# EAGLE design gecko (EAGLE 5.11)

## Sheet 1 of 3
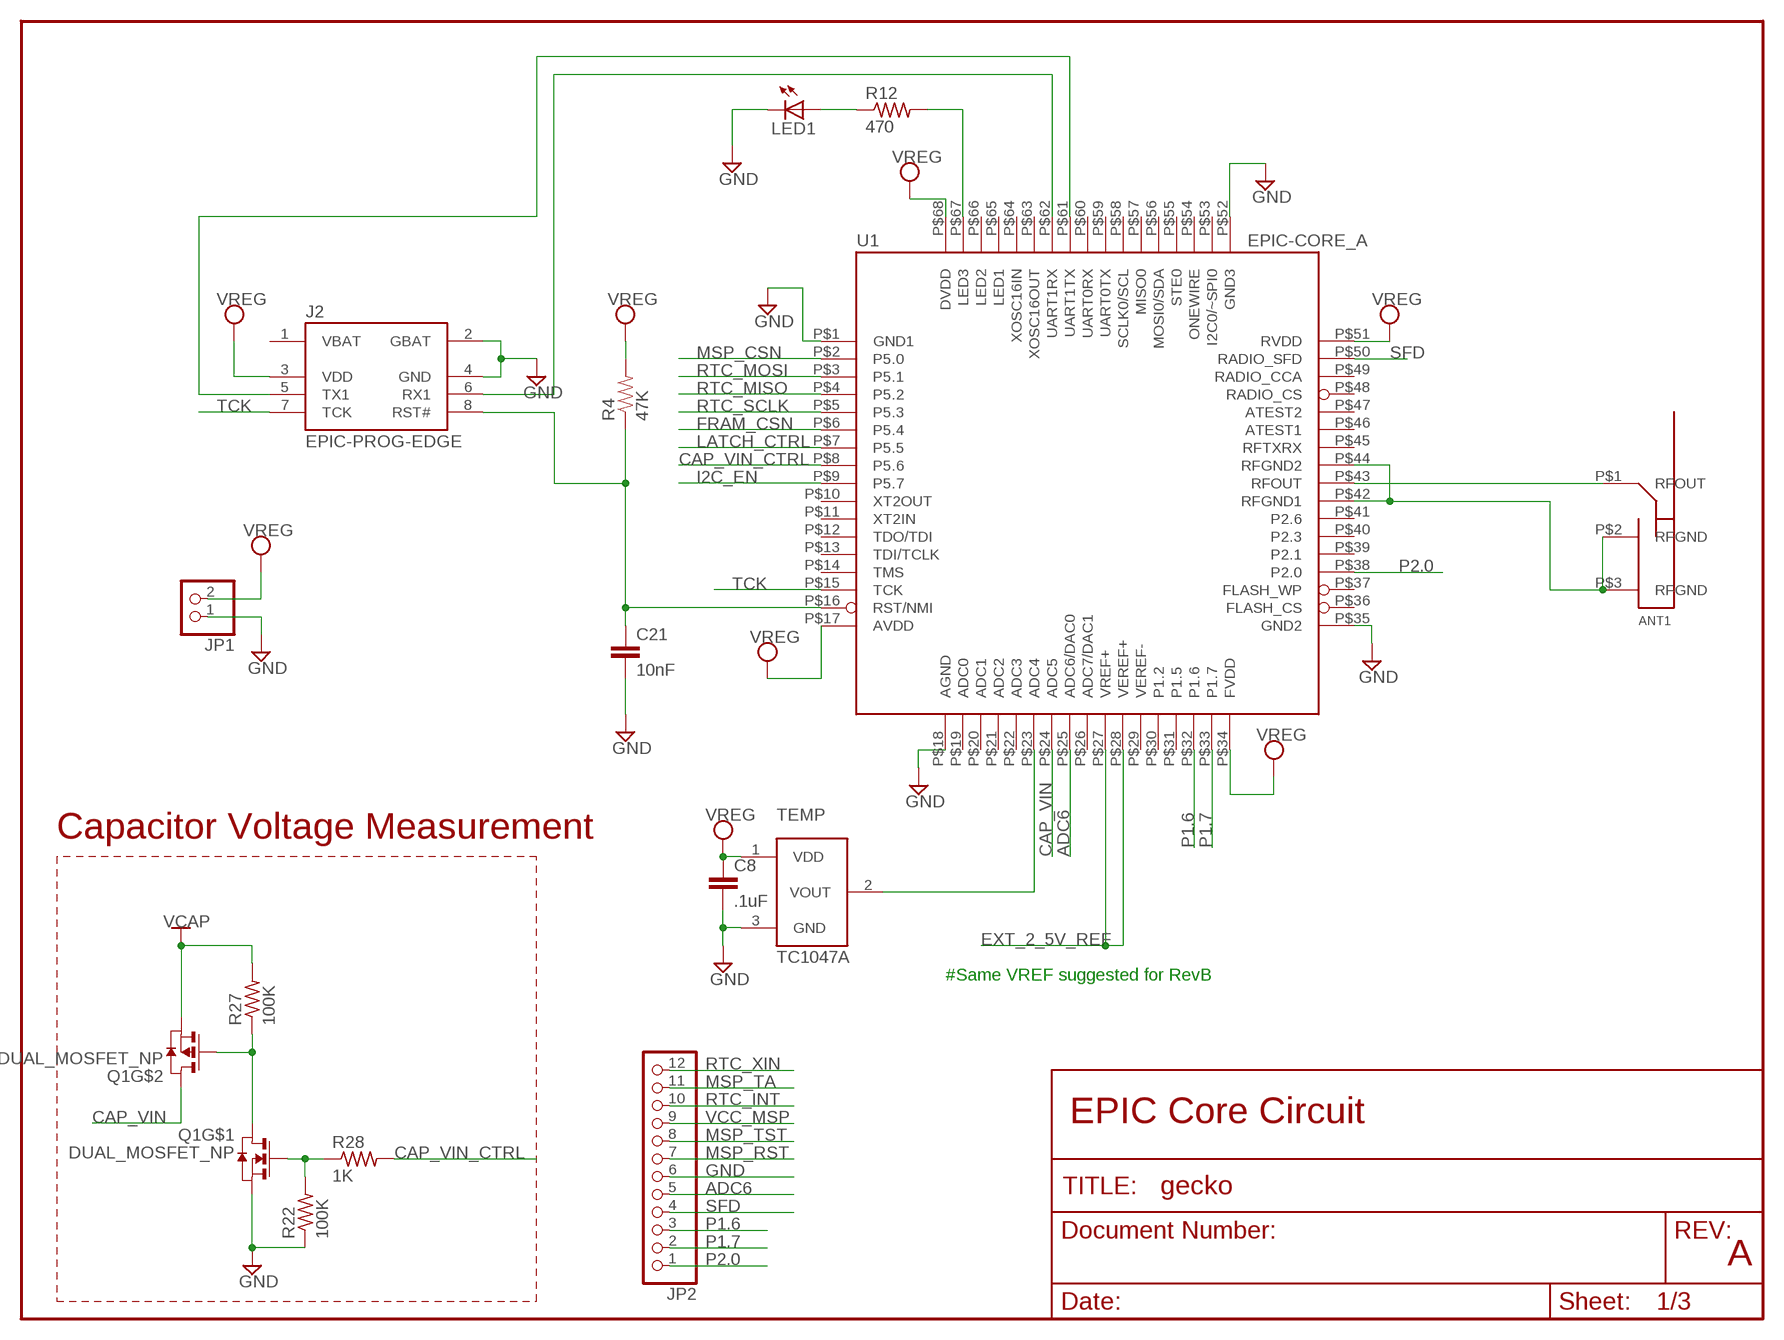
[diagram p0: schematic, sheet 1]

### Parts
ANT1  PIFA-2.4GHZ  [PIFA-2.4GHZ]
C8  .1uF  CAPACITOR  [C0603B]
C21  10nF  CAPACITOR  [C0603B]
J2  EPIC-PROG-EDGE  [EPIC-PROG-EDGE]
JP1  PINHD-1X2M  [1X02M]
JP2  PINHD-1X12M  [1X12M]
LED1  LED0603  [LED-0603]
Q1  DUAL_MOSFET_NP  [TSOP-6]
R4  47K  RESISTOR0603-RES  [0603-RES]
R12  470  RESISTOR  [R0603B]
R22  100K  RESISTOR  [R0603B]
R27  100K  RESISTOR  [R0603B]
R28  1K  RESISTOR  [R0603B]
TEMP  TC1047A  [SOT-23-3]
U1  EPIC-CORE_A  [EPIC-LCC68]

### Nets
ADC6: JP2.5 U1.P$25(ADC6/DAC0)
CAP_VIN: Q1.P$4(D) U1.P$24(ADC5)
CAP_VIN_CTRL: R28.2 U1.P$8(P5.6)
EXT_2_5V_REF: U1.P$27(VREF+) U1.P$28(VEREF+)
FRAM_CSN: U1.P$6(P5.4) ; also sheet 3
GND: C8.2 C21.2 J2.2(GBAT) J2.4(GND) JP1.1 JP2.6 LED1.C Q1.P$5(S) R22.1 TEMP.3(GND) U1.P$1(GND1) U1.P$18(AGND) U1.P$35(GND2) U1.P$52(GND3) ; also sheet 2,3
I2C_EN: U1.P$9(P5.7) ; also sheet 3
LATCH_CTRL: U1.P$7(P5.5) ; also sheet 2
MSP_CSN: U1.P$2(P5.0) ; also sheet 3
MSP_RST: JP2.7 ; also sheet 3
MSP_TA: JP2.11 ; also sheet 3
MSP_TST: JP2.8 ; also sheet 3
N$1: ANT1.P$1(RFOUT) U1.P$43(RFOUT)
N$6: Q1.P$3(G) Q1.P$6(D) R27.1
N$7: J2.6(RX1) U1.P$62(UART1RX)
N$11: J2.5(TX1) U1.P$61(UART1TX)
N$12: Q1.P$1(G) R22.2 R28.1
N$14: R12.2 U1.P$67(LED3)
N$15: LED1.A R12.1
N$17: C21.1 J2.8(RST#) R4.1 U1.P$16(RST/NMI)
N$20: TEMP.2(VOUT) U1.P$23(ADC4)
P1.6: JP2.3 U1.P$32(P1.6)
P1.7: JP2.2 U1.P$33(P1.7)
P2.0: JP2.1 U1.P$38(P2.0)
RFGND: ANT1.P$2(RFGND) ANT1.P$3(RFGND) U1.P$42(RFGND1) U1.P$44(RFGND2)
RTC_INT: JP2.10 ; also sheet 2,3
RTC_MISO: U1.P$4(P5.2) ; also sheet 3
RTC_MOSI: U1.P$3(P5.1) ; also sheet 3
RTC_SCLK: U1.P$5(P5.3) ; also sheet 3
RTC_XIN: JP2.12 ; also sheet 3
SFD: JP2.4 U1.P$50(RADIO_SFD) ; also sheet 3
TCK: J2.7(TCK) U1.P$15(TCK)
VCAP: Q1.P$2(S) R27.2 ; also sheet 2
VCC_MSP: JP2.9 ; also sheet 3
VREG: C8.1 J2.3(VDD) JP1.2 R4.2 TEMP.1(VDD) U1.P$17(AVDD) U1.P$34(FVDD) U1.P$51(RVDD) U1.P$68(DVDD) ; also sheet 2,3
Unconnected: J2.1(VBAT) U1.P$10(XT2OUT) U1.P$11(XT2IN) U1.P$12(TDO/TDI) U1.P$13(TDI/TCLK) U1.P$14(TMS) U1.P$19(ADC0) U1.P$20(ADC1) U1.P$21(ADC2) U1.P$22(ADC3) U1.P$26(ADC7/DAC1) U1.P$29(VEREF-) U1.P$30(P1.2) U1.P$31(P1.5) U1.P$36(FLASH_CS) U1.P$37(FLASH_WP) U1.P$39(P2.1) U1.P$40(P2.3) U1.P$41(P2.6) U1.P$45(RFTXRX) U1.P$46(ATEST1) U1.P$47(ATEST2) U1.P$48(RADIO_CS) U1.P$49(RADIO_CCA) U1.P$53(I2C0/~SPI0) U1.P$54(ONEWIRE) U1.P$55(STE0) U1.P$56(MOSI0/SDA) U1.P$57(MISO0) U1.P$58(SCLK0/SCL) U1.P$59(UART0TX) U1.P$60(UART0RX) U1.P$63(XOSC16OUT) U1.P$64(XOSC16IN) U1.P$65(LED1) U1.P$66(LED2)

### Notes on the sheet
- Capacitor Voltage Measurement
- #Same VREF suggested for RevB
- EPIC Core Circuit
- A

## Sheet 2 of 3
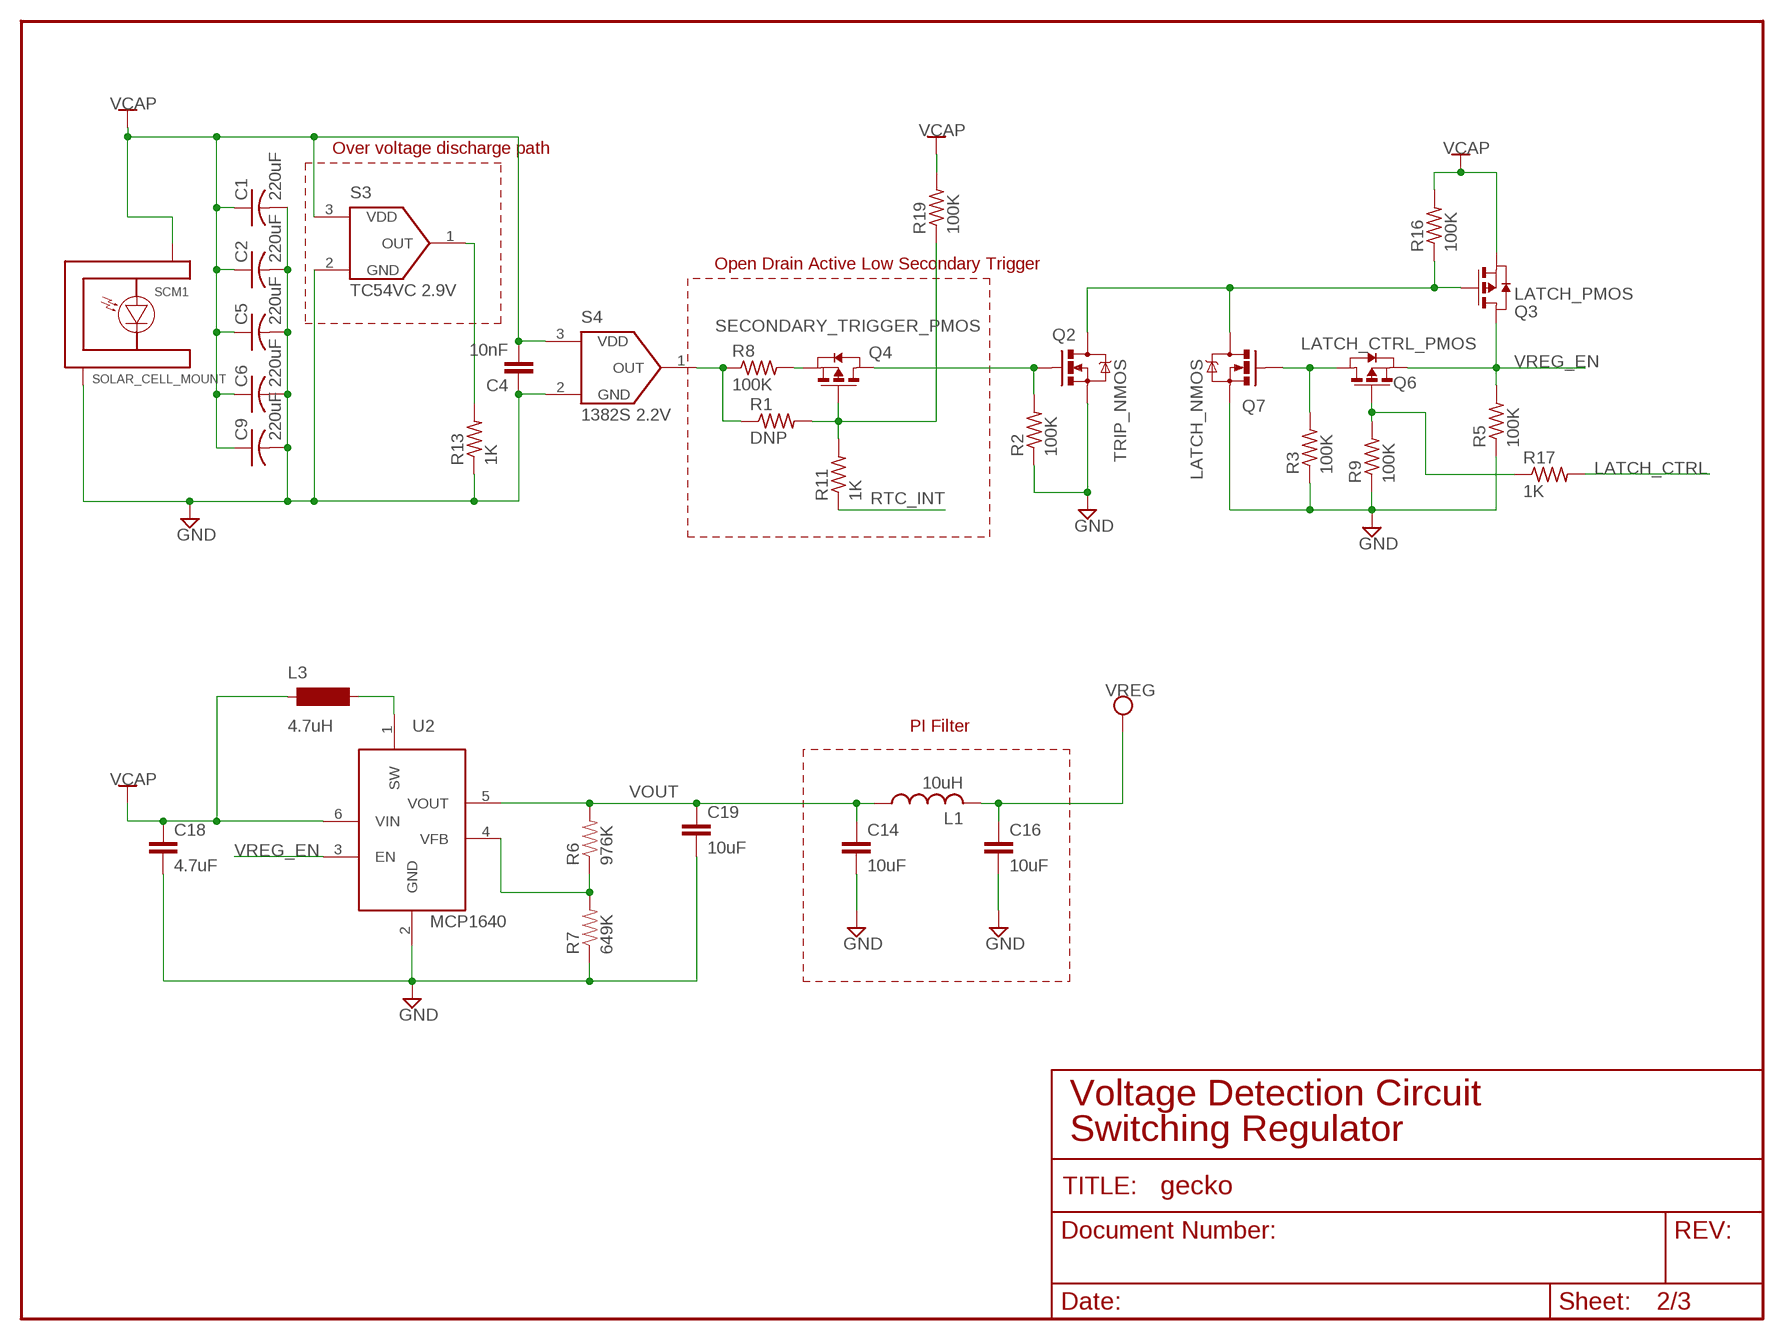
[diagram p1: schematic, sheet 2]

### Parts
C1  220uF  C-USC1206  [C1206]
C2  220uF  C-USC1206  [C1206]
C4  10nF  CAPACITOR  [C0603B]
C5  220uF  C-USC1206  [C1206]
C6  220uF  C-USC1206  [C1206]
C9  220uF  C-USC1206  [C1206]
C14  10uF  CAP0805  [0805]
C16  10uF  CAP0805  [0805]
C18  4.7uF  CAP0603-CAP  [0603-CAP]
C19  10uF  CAP0805  [0805]
L1  10uH  L-USL2012C  [L2012C]
L3  4.7uH  INDUCTOR  [INDUCTOR]
Q2  TRIP_NMOS  MOSFET-NCHANNELSMD  [SOT23-3]
Q3  LATCH_PMOS  PMOSSOT23  [SOT-23]
Q4  SECONDARY_TRIGGER_PMOS  PMOSSOT23  [SOT-23]
Q6  LATCH_CTRL_PMOS  PMOSSOT23  [SOT-23]
Q7  LATCH_NMOS  MOSFET-NCHANNELSMD  [SOT23-3]
R1  DNP  RESISTOR  [R0603B]
R2  100K  RESISTOR  [R0603B]
R3  100K  RESISTOR  [R0603B]
R5  100K  RESISTOR  [R0603B]
R6  976K  RESISTOR0603-RES  [0603-RES]
R7  649K  RESISTOR0603-RES  [0603-RES]
R8  100K  RESISTOR  [R0603B]
R9  100K  RESISTOR  [R0603B]
R11  1K  RESISTOR  [R0603B]
R13  1K  RESISTOR  [R0603B]
R16  100K  RESISTOR  [R0603B]
R17  1K  RESISTOR  [R0603B]
R19  100K  RESISTOR  [R0603B]
S3  TC54VC 2.9V  1382  [SOT-23-3]
S4  1382S 2.2V  1382  [SOT-23-3]
SCM1  SOLAR_CELL_MOUNT  [SOLAR_CELL_MOUNT]
U2  MCP1640  [SOT-23-6]

### Nets
GND: C1.2 C2.2 C4.1 C5.2 C6.2 C9.2 C14.2 C16.2 C18.2 C19.2 Q2.2(S) Q7.2(S) R2.1 R3.1 R5.1 R7.1 R9.1 R13.1 S3.2(GND) S4.2(GND) SCM1.NEG U2.2(GND) ; also sheet 1,3
LATCH_CTRL: R17.2 ; also sheet 1
N$2: Q2.1(G) Q4.1(D) R2.2
N$3: L3.2 U2.1(SW)
N$4: R1.1 R8.1 S4.1(OUT)
N$5: R6.1 R7.2 U2.4(VFB)
N$9: Q2.3(D) Q3.3(G) Q7.3(D) R16.1
N$10: Q4.2(S) R8.2
N$16: R13.2 S3.1(OUT)
N$23: Q6.1(D) Q7.1(G) R3.2
N$24: Q6.3(G) R9.2 R17.1
N$25: Q4.3(G) R1.2 R11.2 R19.1
RTC_INT: R11.1 ; also sheet 1,3
VCAP: C1.1 C2.1 C4.2 C5.1 C6.1 C9.1 C18.1 L3.1 Q3.2(S) R16.2 R19.2 S3.3(VDD) S4.3(VDD) SCM1.POS U2.6(VIN) ; also sheet 1
VOUT: C14.1 C19.1 L1.1 R6.2 U2.5(VOUT)
VREG: C16.1 L1.2 ; also sheet 1,3
VREG_EN: Q3.1(D) Q6.2(S) R5.2 U2.3(EN)

### Notes on the sheet
- Over voltage discharge path
- Open Drain Active Low Secondary Trigger
- PI Filter
- Voltage Detection Circuit
- Switching Regulator

## Sheet 3 of 3
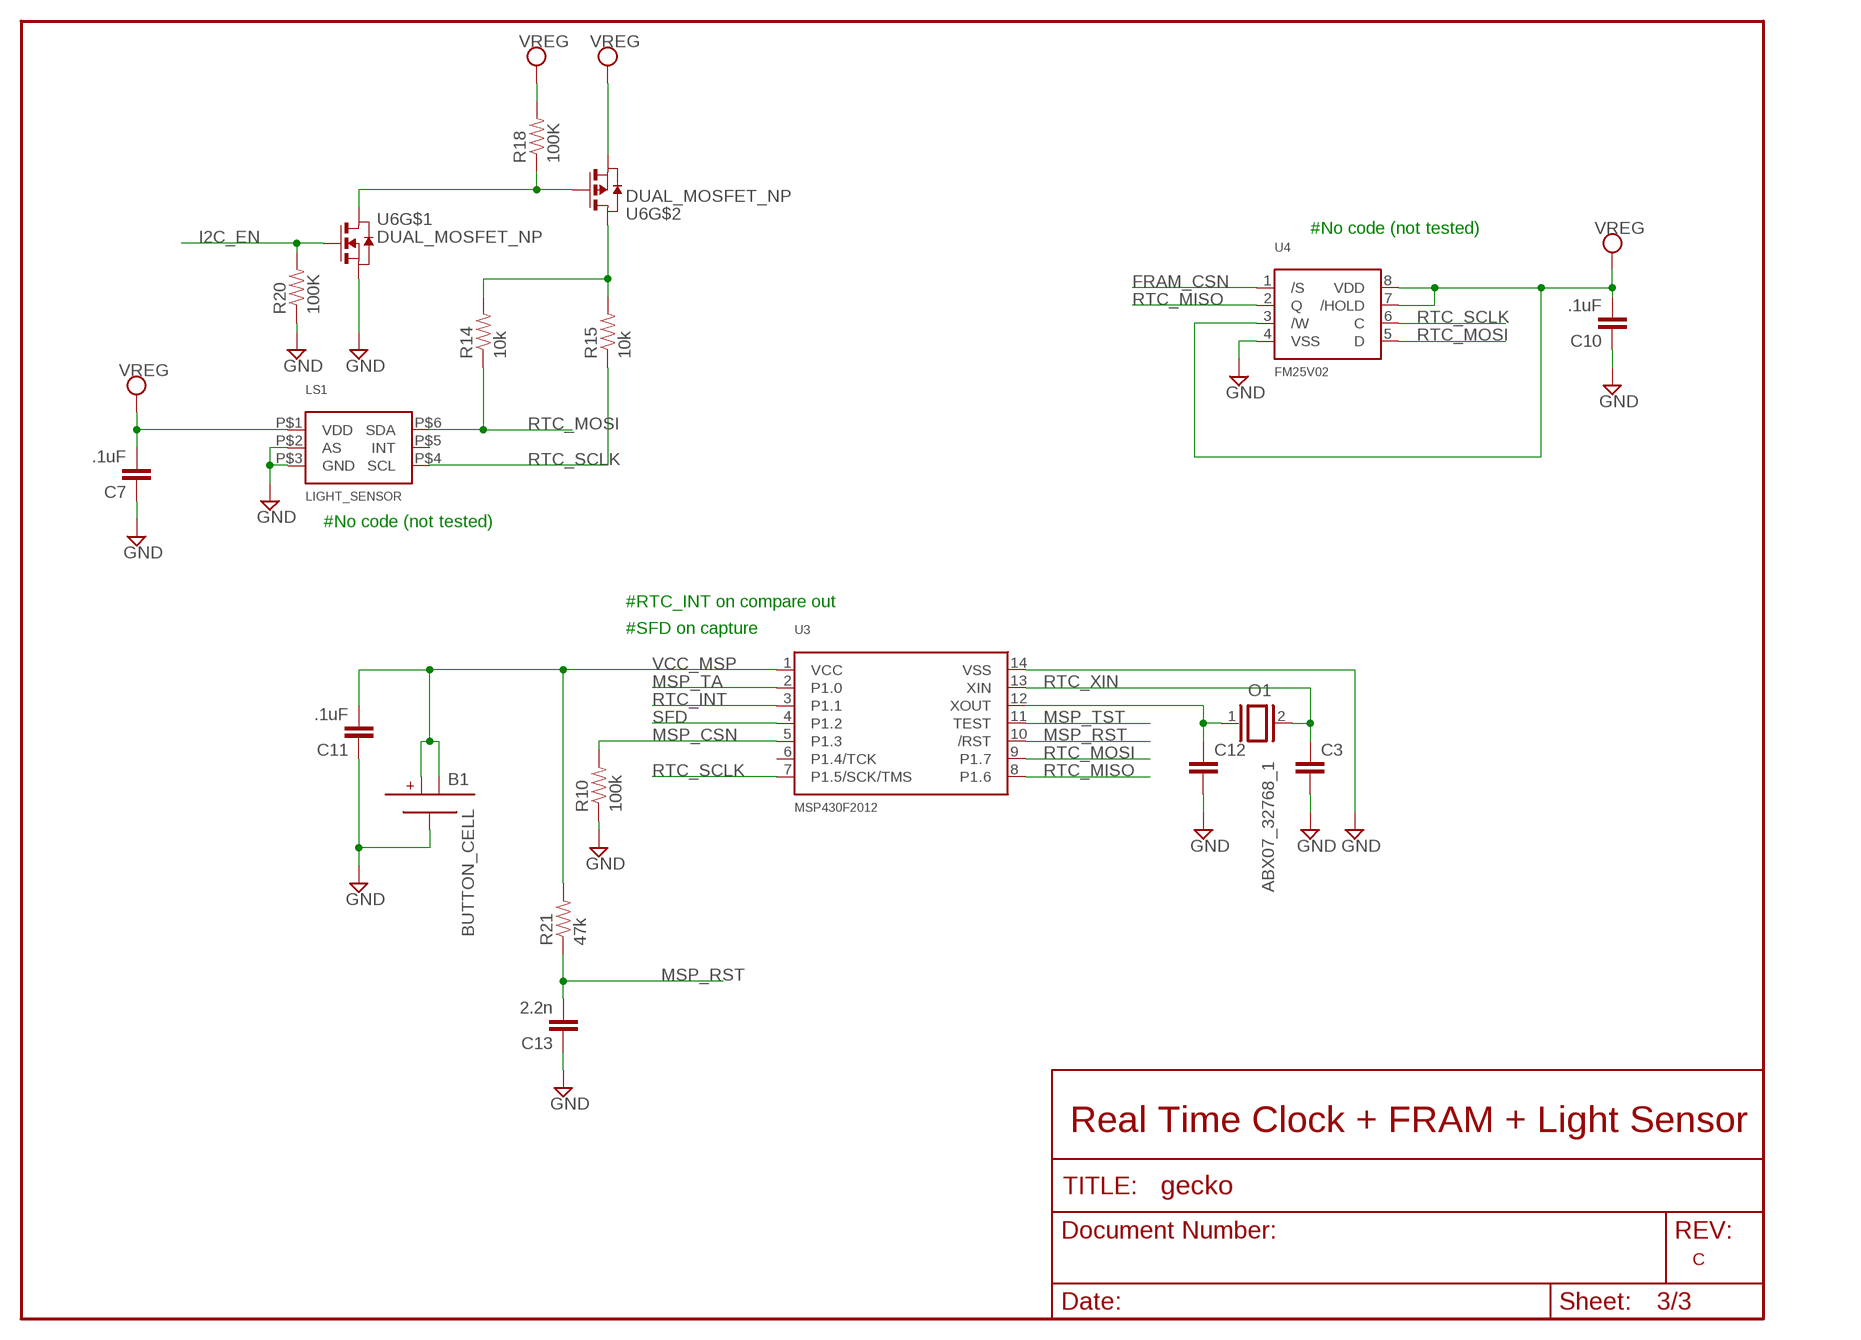
[diagram p2: schematic, sheet 3]

### Parts
B1  BUTTON_CELL  [RETAINER_3000]
C3  CAP0603-CAP  [0603-CAP]
C7  .1uF  CAP0603-CAP  [0603-CAP]
C10  .1uF  CAP0603-CAP  [0603-CAP]
C11  .1uF  CAP0603-CAP  [0603-CAP]
C12  CAP0603-CAP  [0603-CAP]
C13  2.2n  CAP0603-CAP  [0603-CAP]
LS1  LIGHT_SENSOR  [DFNL-6]
O1  ABX07_32768_1  [ABS07_XTAL]
R10  100k  RESISTOR0603-RES  [0603-RES]
R14  10k  RESISTOR0603-RES  [0603-RES]
R15  10k  RESISTOR0603-RES  [0603-RES]
R18  100K  RESISTOR0603-RES  [0603-RES]
R20  100K  RESISTOR0603-RES  [0603-RES]
R21  47k  RESISTOR0603-RES  [0603-RES]
U3  MSP430F2012  [TSSOP14]
U4  FM25V02  [SOIC8]
U6  DUAL_MOSFET_NP  [TSOP-6]

### Nets
FRAM_CSN: U4.1(/S) ; also sheet 1
GND: B1.NEG C3.2 C7.1 C10.1 C11.1 C12.2 C13.1 LS1.P$2(AS) LS1.P$3(GND) R10.1 R20.1 U3.14(VSS) U4.4(VSS) U6.P$5(S) ; also sheet 1,2
I2C_EN: R20.2 U6.P$1(G) ; also sheet 1
MSP_CSN: R10.2 U3.5(P1.3) ; also sheet 1
MSP_RST: C13.2 R21.1 U3.10(/RST) ; also sheet 1
MSP_TA: U3.2(P1.0) ; also sheet 1
MSP_TST: U3.11(TEST) ; also sheet 1
N$18: C12.1 O1.1 U3.12(XOUT)
N$21: R14.2 R15.2 U6.P$4(D)
N$22: R18.1 U6.P$3(G) U6.P$6(D)
RTC_INT: U3.3(P1.1) ; also sheet 1,2
RTC_MISO: U3.8(P1.6) U4.2(Q) ; also sheet 1
RTC_MOSI: LS1.P$6(SDA) R14.1 U3.9(P1.7) U4.5(D) ; also sheet 1
RTC_SCLK: LS1.P$4(SCL) R15.1 U3.7(P1.5/SCK/TMS) U4.6(C) ; also sheet 1
RTC_XIN: C3.1 O1.2 U3.13(XIN) ; also sheet 1
SFD: U3.4(P1.2) ; also sheet 1
VCC_MSP: B1.POS1 B1.POS2 C11.2 R21.2 U3.1(VCC) ; also sheet 1
VREG: C7.2 C10.2 LS1.P$1(VDD) R18.2 U4.3(/W) U4.7(/HOLD) U4.8(VDD) U6.P$2(S) ; also sheet 1,2
Unconnected: LS1.P$5(INT) U3.6(P1.4/TCK)

### Notes on the sheet
- #No code (not tested)
- #No code (not tested)
- #RTC_INT on compare out
- #SFD on capture
- Real Time Clock + FRAM + Light Sensor
- C

## Library data of the parts
ANT1 = berkeley-epic:PIFA-2.4GHZ
B1 = mylibrary:BUTTON_CELL
C1 C2 C5 C6 C9 = rcl:C-US: CAPACITOR, American symbol
C3 C7 C10-C14 C16 C18 C19 = SparkFun:CAP: Capacitor Standard 0603 ceramic capacitor, and 0.1" leaded capacitor.
C4 C8 C21 = Gecko:CAPACITOR
J2 = berkeley-epic:EPIC-PROG-EDGE
JP1 = pinhead:PINHD-1X2: PIN HEADER
JP2 = pinhead:PINHD-1X12: PIN HEADER
L1 = rcl:L-US: INDUCTOR, American symbol
L3 = mylibrary:INDUCTOR
LED1 = SparkFun:LED: LEDs Standard schematic elements and footprints for 5mm, 3mm, 1206, and 0603 sized LEDs. 5mm - Spark Fun Electronics SKU : COM-00529 (and others)
LS1 =  gecko_vreg_revC:LIGHT_SENSOR
O1 =  gecko_vreg_revC:ABX07_32768_1
Q1 U6 =  gecko_vreg_revC:DUAL_MOSFET_NP
Q2 Q7 = SparkFun:MOSFET-NCHANNEL
Q3 Q4 Q6 = berkeley-epic:PMOSSOT23: MOS FET
R1-R3 R5 R8 R9 R11-R13 R16 R17 R19 R22 R27 R28 = Gecko:RESISTOR
R4 R6 R7 R10 R14 R15 R18 R20 R21 = SparkFun:RESISTOR: Resistor Basic schematic elements and footprints for 0603, 1206, and PTH resistors.
S3 S4 = Gecko:1382
SCM1 = mylibrary:SOLAR_CELL_MOUNT
TEMP = mylibrary:TC1047A
U1 = berkeley-epic:EPIC-CORE_A
U2 = mylibrary:MCP1640
U3 =  gecko_vreg_revC:MSP430F2012
U4 =  gecko_vreg_revC:FM25V02

## Board
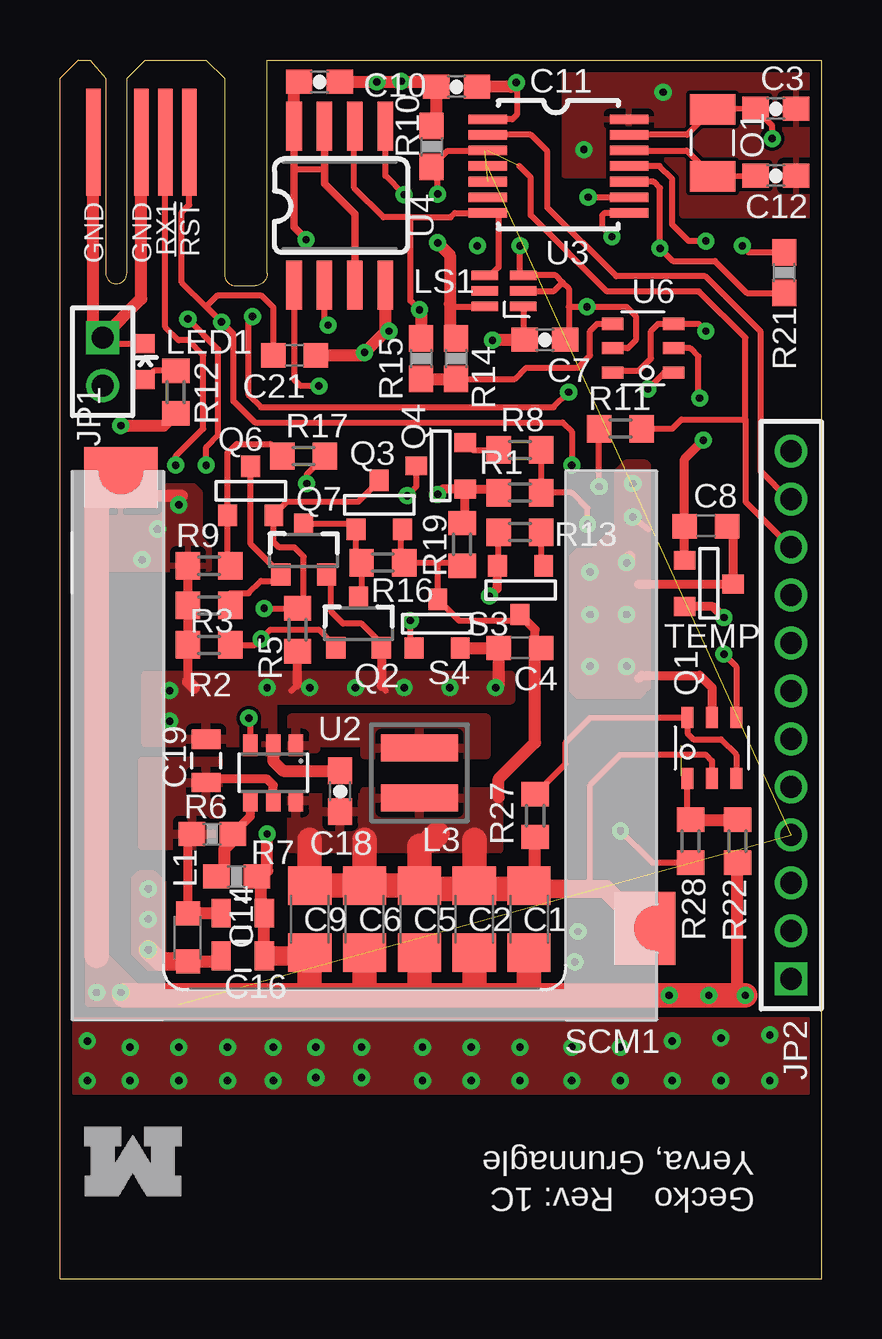
[diagram p3: board, top side]
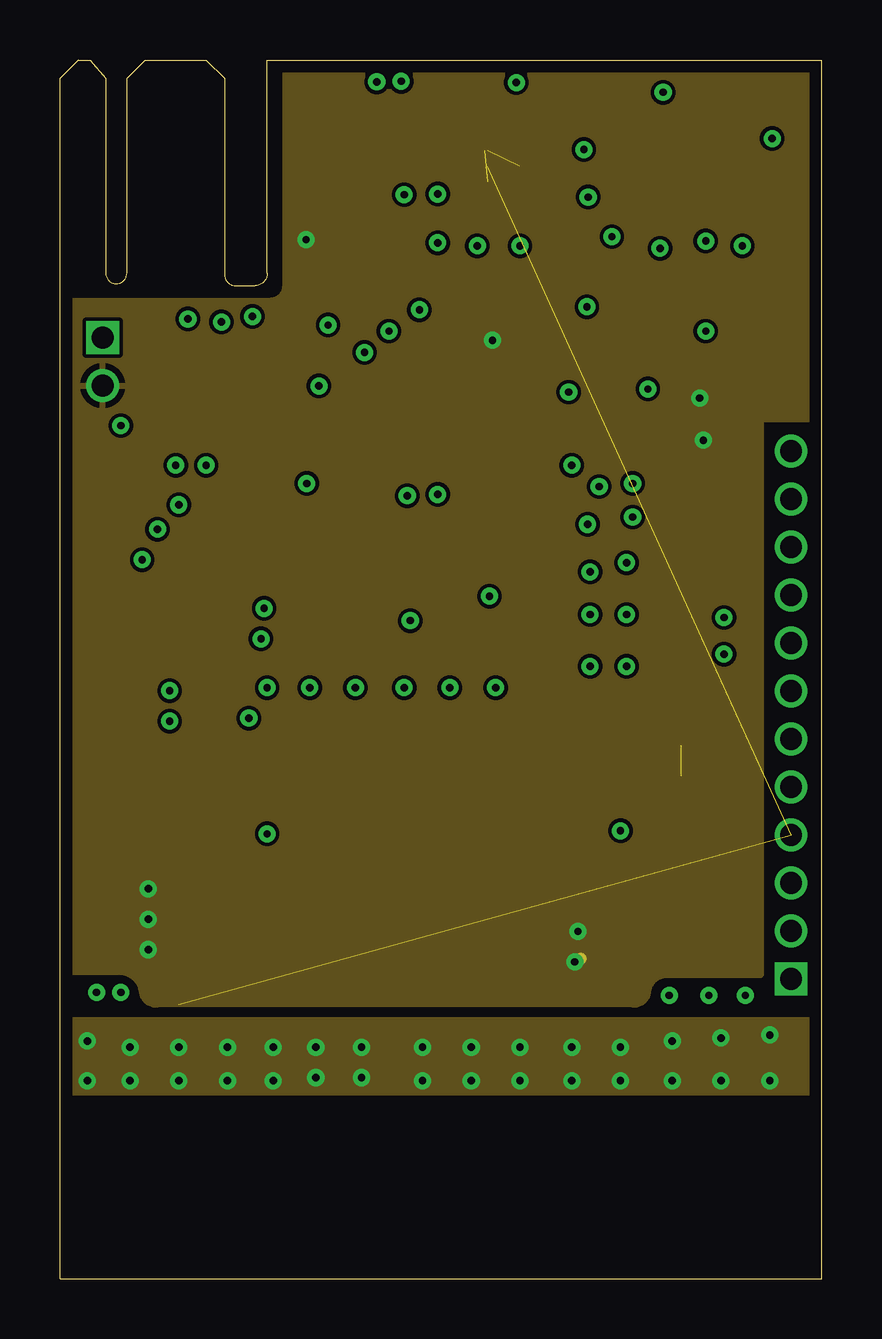
[diagram p4: board, inner layer Power]
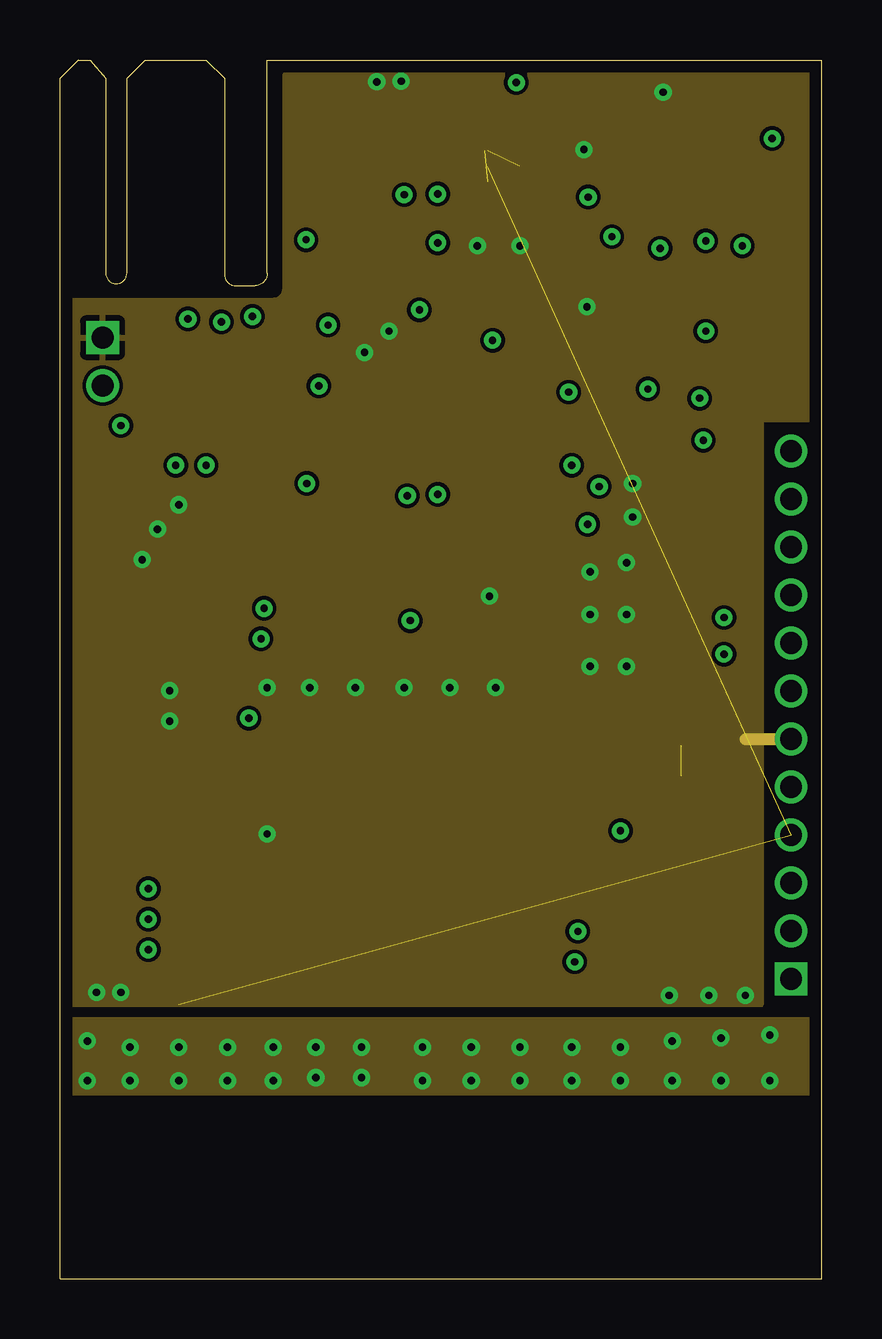
[diagram p5: board, inner layer Ground]
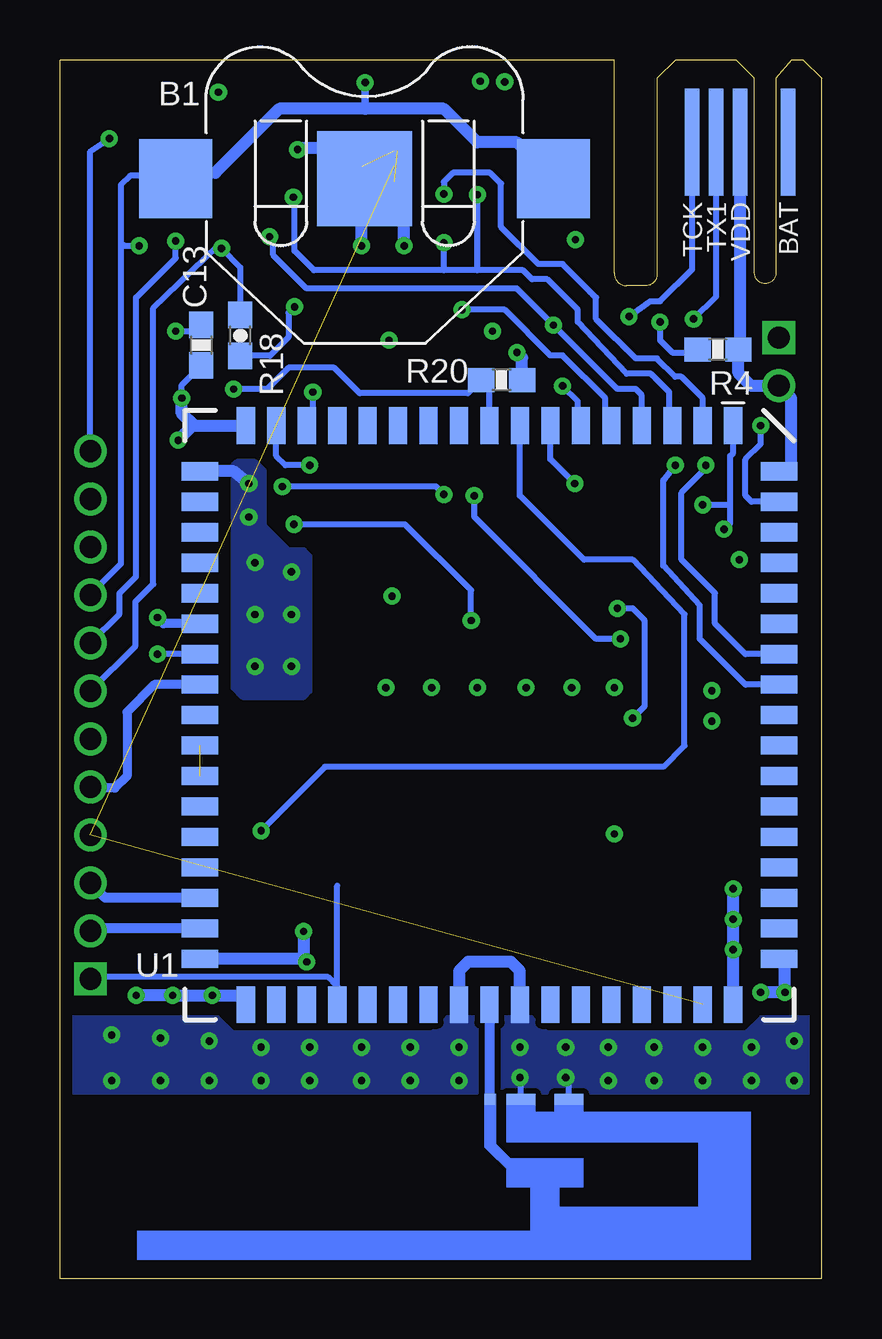
[diagram p6: board, bottom side, seen from below]

Size 31.75 x 50.8 mm. Coordinates in mm from the lower left corner, seen from the top.
Outline: 1.27,50.8 1.91,50.04 1.91,41.91 arc177 2.79,41.91 2.79,50.04 3.56,50.8 6.1,50.8 6.86,50.04 6.86,41.91 arc90 7.29,41.39 8.13,41.39 arc93 8.64,41.91 8.64,50.8 31.75,50.8 31.75,0 0,0 0,50.04 0.76,50.8 1.27,50.8
Copper layers (1+2*15+16): Top 0.0178mm / dielectric 0.3048mm / Power 0.0356mm / dielectric 0.7112mm / Ground 0.0356mm / dielectric 0.3048mm / Bottom 0.0178mm
Design rules "SSC-EAGLE-4Lyr_v1.0.0.3 *": minimum track width 6mil, minimum drill 8mil, track to track 6mil, track to pad 6mil, pad to pad 6mil, via to via 6mil, smd to smd 6mil, copper to edge 20mil, drill to drill 16mil, minimum pad ring 8mil, minimum via ring 8mil, stop-mask expansion 3mil, vias tented up to drill 20mil, thermal gap 10mil

### Footprints (pad centres in the part's own frame; a part is rotated, then mirrored left to right if it is on the bottom)
PIFA-2.4GHZ = smd 0.46 x 0.46: P$1 -2.65,-1.495 | smd 0.46 x 1.2: P$2 -2.655,1.785; P$3 -2.65,-0.215
RETAINER_3000 = smd 3.962 x 3.962: NEG 0,0 | smd 3.048 x 3.302: POS1 -7.874,0; POS2 7.874,0
C1206 = smd 1.6 x 1.8: 1 -1.4,0; 2 1.4,0
0603-CAP = smd 1.1 x 1: 1 -0.85,0; 2 0.85,0
C0603B = smd 1.016 x 1.016: 1 -0.889,0; 2 0.889,0
0805 = smd 0.8 x 1.2: 1 -0.9,0; 2 0.9,0
EPIC-PROG-EDGE = smd 0.61 x 4.445: 1 -1.001,3.619; 3 1.001,3.619; 5 2.002,3.619; 7 3.002,3.619 | smd 0.61 x 4.445 bottom: 2 -1.001,3.619; 4 1.001,3.619; 6 2.002,3.619; 8 3.002,3.619
1X02M = drill 0.914 square: 1 -1,0 | drill 0.914 round: 2 1,0
1X12M = drill 0.914 square: 1 -11,0 | drill 0.914 round: 2 -9,0; 3 -7,0; 4 -5,0; 5 -3,0; 6 -1,0; 7 1,0; 8 3,0; 9 5,0; 10 7,0; 11 9,0; 12 11,0
L2012C = smd 1 x 1: 1 -1,0; 2 1,0
INDUCTOR = smd 1.118 x 3.2: 1 -1.041,0; 2 1.041,0
LED-0603 = smd 0.8 x 0.8: A 0,-0.75; C 0,0.75
DFNL-6 = smd 1.1 x 0.4: P$1 -0.8,0.65; P$2 -0.8,0; P$3 -0.8,-0.65; P$4 0.8,-0.65; P$5 0.8,0; P$6 0.8,0.65
ABS07_XTAL = smd 1.27 x 1.905: 1 -1.397,0; 2 1.397,0
TSOP-6 = smd 0.508 x 0.889: P$1 -1.016,-1.27; P$2 0,-1.27; P$3 1.016,-1.27; P$4 1.016,1.27; P$5 0,1.27; P$6 -1.016,1.27
SOT23-3 = smd 0.8 x 0.9: 1 -0.95,-1; 2 0.95,-1; 3 0,1.1
SOT-23 = smd 0.787 x 0.889: 1 0.025,-1.016; 2 -0.94,1.016; 3 0.991,1.016
R0603B = smd 1.016 x 1.143: 1 -0.889,0; 2 0.889,0
0603-RES = smd 1.1 x 1: 1 -0.85,0; 2 0.85,0
SOT-23-3 = smd 0.787 x 0.889: 1 -0.991,-1.016; 2 0.94,-1.016; 3 0,1.016
SOLAR_CELL_MOUNT = smd 2.54 x 3.048: NEG 22.606,22.352 | smd 3.048 x 2.54: POS 3.81,0.508
EPIC-LCC68 = smd 1.524 x 0.762: P$1 -12.065,10.16; P$2 -12.065,8.89; P$3 -12.065,7.62; P$4 -12.065,6.35; P$5 -12.065,5.08; P$6 -12.065,3.81; P$7 -12.065,2.54; P$8 -12.065,1.27; P$9 -12.065,0; P$10 -12.065,-1.27; P$11 -12.065,-2.54; P$12 -12.065,-3.81; P$13 -12.065,-5.08; P$14 -12.065,-6.35; P$15 -12.065,-7.62; P$16 -12.065,-8.89; P$17 -12.065,-10.16; P$35 12.065,-10.16; P$36 12.065,-8.89; P$37 12.065,-7.62; P$38 12.065,-6.35; P$39 12.065,-5.08; P$40 12.065,-3.81; P$41 12.065,-2.54; P$42 12.065,-1.27; P$43 12.065,0; P$44 12.065,1.27; P$45 12.065,2.54; P$46 12.065,3.81; P$47 12.065,5.08; P$48 12.065,6.35; P$49 12.065,7.62; P$50 12.065,8.89; P$51 12.065,10.16 | smd 0.762 x 1.524: P$18 -10.16,-12.065; P$19 -8.89,-12.065; P$20 -7.62,-12.065; P$21 -6.35,-12.065; P$22 -5.08,-12.065; P$23 -3.81,-12.065; P$24 -2.54,-12.065; P$25 -1.27,-12.065; P$26 0,-12.065; P$27 1.27,-12.065; P$28 2.54,-12.065; P$29 3.81,-12.065; P$30 5.08,-12.065; P$31 6.35,-12.065; P$32 7.62,-12.065; P$33 8.89,-12.065; P$34 10.16,-12.065; P$52 10.16,12.065; P$53 8.89,12.065; P$54 7.62,12.065; P$55 6.35,12.065; P$56 5.08,12.065; P$57 3.81,12.065; P$58 2.54,12.065; P$59 1.27,12.065; P$60 0,12.065; P$61 -1.27,12.065; P$62 -2.54,12.065; P$63 -3.81,12.065; P$64 -5.08,12.065; P$65 -6.35,12.065; P$66 -7.62,12.065; P$67 -8.89,12.065; P$68 -10.16,12.065
SOT-23-6 = smd 0.6 x 0.9: 1 -0.95,-1.15; 2 0,-1.15; 3 0.95,-1.15; 4 0.95,1.15; 5 0,1.15; 6 -0.95,1.15
TSSOP14 = smd 0.4 x 1.6: 1 -1.971,-2.85; 2 -1.321,-2.85; 3 -0.671,-2.85; 4 -0.021,-2.85; 5 0.629,-2.85; 6 1.279,-2.85; 7 1.929,-2.85; 8 1.929,3.05; 9 1.279,3.05; 10 0.629,3.05; 11 -0.021,3.05; 12 -0.671,3.05; 13 -1.321,3.05; 14 -1.971,3.05
SOIC8 = smd 0.66 x 2.032: 1 -1.905,-3.315; 2 -0.635,-3.315; 3 0.635,-3.315; 4 1.905,-3.315; 5 1.905,3.315; 6 0.635,3.315; 7 -0.635,3.315; 8 -1.905,3.315

### Placement (x,y rotation side)
ANT1  12.32,4.83 270 bottom
B1  19.05,45.85 0 bottom
C1  19.56,14.99 270 top
C2  17.27,14.99 270 top
C3  29.84,48.77 0 top
C4  19.18,26.29 0 top
C5  14.99,14.99 270 top
C6  12.7,14.99 270 top
C7  20.22,39.14 180 top
C8  26.92,31.37 0 top
C9  10.41,14.99 270 top
C10  10.82,49.89 180 top
C11  16.54,49.68 0 top
C12  29.84,45.97 0 top
C13  24.23,39.32 90 bottom
C14  7.62,15.24 0 top
C16  7.62,13.46 0 top
C18  11.68,20.32 90 top
C19  6.1,21.59 90 top
C21  9.78,38.48 0 top
J2  2.39,51 180 bottom
JP1  1.78,38.23 270 top
JP2  30.48,23.5 90 top
L1  5.33,14.22 270 top
L3  14.99,21.08 90 top
LED1  3.56,38.23 0 top
LS1  18.52,41.17 180 top
O1  27.2,47.35 90 top
Q1  27.18,22.12 0 top
Q2  12.45,27.3 0 top
Q3  13.34,32.26 180 top
Q4  15.88,33.91 270 top
Q6  7.98,32.84 180 top
Q7  10.16,30.35 0 top
R1  19.18,32.77 180 top
R2  6.22,26.42 0 top
R3  6.22,28.07 0 top
R4  4.32,38.73 0 bottom
R5  9.91,27.05 90 top
R6  6.35,18.54 180 top
R7  7.37,16.76 180 top
R8  19.18,34.54 180 top
R9  6.22,29.72 0 top
R10  15.49,47.19 270 top
R11  23.37,35.43 180 top
R12  4.83,36.96 270 top
R13  19.18,31.11 0 top
R14  16.51,38.35 270 top
R15  15.06,38.35 270 top
R16  13.46,29.84 0 top
R17  10.16,34.29 0 top
R18  25.86,38.91 270 bottom
R19  16.76,30.61 270 top
R20  13.34,37.47 180 bottom
R21  30.2,41.94 90 top
R22  28.24,18.24 90 top
R27  19.81,19.3 270 top
R28  26.29,18.24 270 top
S3  19.18,28.7 180 top
S4  15.75,27.3 0 top
SCM1  24.89,10.79 90 top
TEMP  27.05,28.96 270 top
U1  13.84,23.5 270 bottom
U2  8.89,21.08 180 top
U3  20.68,46.35 270 top
U4  11.66,44.73 0 top
U6  24.31,38.79 90 top
U$1  [BLOCK-M]  5.08,6.35 180 top

### Tracks (layer width: path | path; a pad name or v marks a point on that pad's centre or on a via)
ADC6
  Bottom 0.381: U1.P$25 27.81,24.77 28.96,23.62 28.96,20.95 29.46,20.45 30.43,20.45 JP2.5
CAP_VIN  (via drill 0.3)
  Top 0.254: Q1.P$4 28.19,25.53 v27.69,26.04
  Bottom 0.254: U1.P$24 v27.69,26.04
CAP_VIN_CTRL  (via drill 0.3)
  Top 0.254: 26.21,17.27 R28.2 24.69,17.35 v23.37,18.67
  Bottom 0.254: U1.P$8 12.57,32.64 9.91,29.97 7.87,29.97 5.71,27.69 5.71,22.23 6.6,21.34 20.7,21.34 v23.37,18.67
EXT_2_5V_REF  (1 unrouted)
FRAM_CSN  (via drill 0.3)
  Top 0.254: U4.1 9.75,40.79 9.78,40.77 9.78,37.47 10.03,37.21 v10.79,37.21
  Bottom 0.254: v10.79,37.21 10.16,36.58 10.16,35.69 U1.P$6
GND  (via drill 0.3)
  Top 0.254: 13.4,24.7 13.59,24.51 | 9.91,24.77 9.65,24.51 | Q7.2 11.3,29.03 11.3,27.81 11.81,27.3 12.57,27.3 13.4,26.48 Q2.2 | LED1.C 2.03,38.98 JP1.1 | v23.88,31.75 24.51,31.24 | R13.1 18.29,29.89 S3.2 | v19.18,43.05 19.18,41.82 LS1.P$3 20.66,41.82 20.95,41.53 | 20.95,41.53 21.21,41.27 21.21,40.51 | 21.21,40.51 21.21,39.16 C7.1 | LS1.P$2 20.6,41.17 20.95,41.53 | 21.21,40.51 v21.97,40.51 23.62,40.51 24,40.13 24,39.12 23.67,38.79 U6.P$5
  Top 0.305: 23.09,48.33 U3.14 23.62,48.35
  Top 0.381: C14.2 8.38,15.61 | 8.38,17.02 R7.1 | S3.2 18.23,28.77 v17.91,28.45 | Q2.2 13.4,24.7 | 9.91,24.77 R5.1 | R9.1 R3.1 R2.1 5.33,24.89 | Q1.P$5 27.18,24.64 26.67,25.15 24.26,25.15 24.13,25.02 | C8.2 28.07,31.11 TEMP.3 24.13,28.96
  Top 0.508: U2.2 8.89,21.59 9.31,21.17 C18.2 11.6,21.34 | 8.38,15.61 8.38,16.76 | 8.38,16.76 8.38,17.02 | C16.2 C14.2 | 1.52,27.18 1.61,27.09 | v8.64,18.54 8.64,17.02 8.38,16.76 | 28.64,11.88 v28.57,11.81 28.25,12.14 R22.1 | 18.29,24.77 C4.1 S4.2 | 5.33,24.89 5.59,24.64 | 3.3,32.64 5.08,32.64 | J2.2 1.39,39.23 JP1.1 3.39,40.84 J2.4 | v23.62,29.84 23.75,30.1 | C10.1 v13.21,49.89 15.36,49.89 C11.1 15.69,48.23 R10.1 | C21.2 12.57,38.48 v12.7,38.61 13.59,39.5 | U4.4 13.56,39.65 v13.72,39.5
  Top 0.762: 26.67,11.81 26.69,11.81
  Top 0.813: C16.2 10.29,13.46 C9.2
  Top 1.016: SCM1.NEG 1.52,32.77 1.52,27.18 1.52,13.46 | 2.67,11.81 10.41,11.81 | 10.41,11.81 12.7,11.81 | 12.7,11.81 14.99,11.81 | 17.27,11.81 19.56,11.81 | 10.41,11.81 C9.2 | 12.7,11.81 C6.2 | 14.99,11.81 C5.2 | 17.27,11.81 C2.2 | 14.99,11.81 17.27,11.81 | 19.56,11.81 C1.2 | 19.56,11.81 26.67,11.81 v27.05,11.81 v28.57,11.81
  Ground 0.254: v23.88,33.15 23.88,33.02
  Ground 0.508: JP2.6 28.59,22.5 28.57,22.48
  Bottom 0.254: U1.P$1 3.68,34.42 3.81,34.29 3.81,32.26 | v4.06,31.24 3.81,31.5 3.81,32.26 | 3.81,32.26 v4.95,32.26 | 19.81,47.12 19.05,46.35 B1.NEG | C13.1 23,38.47 22.23,39.24 22.23,40.26 v21.97,40.51
  Bottom 0.508: U1.P$52 1.52,13.34 v1.52,11.94 v2.54,11.94 | U1.P$35 24,11.81 v25.4,11.81 v27.05,11.81 v28.57,11.81 | U1.P$18 24.51,33.66 v23.88,33.15 | v21.84,47.07 21.79,47.12 19.81,47.12 | v17.4,43.05 17.4,44.32 | v19.18,43.05 19.18,44.45 | 12.32,37.63 R20.1 12.48,38.39 v12.7,38.61
  other vias: 4.57,24.51 18.16,24.64 16.26,24.64 14.35,24.64 12.32,24.64 10.41,24.64 8.64,24.64 4.57,23.24 22.1,25.53 23.62,25.53 25.15,49.45 14.22,49.91 22.1,29.46 22.1,27.69 23.62,27.69 3.43,29.97
  pour Top: 18.8,24.13 18.8,25.15 3.56,25.15 3.56,22.35 8.89,22.35 8.89,24.13
  pour Ground: 0.25,40.77 8.89,40.77 arc90 9.4,41.27 9.4,50.16 31.62,50.16 31.62,35.81 29.21,35.81 29.21,11.43 0.25,11.43
  pour Top: 1.27,13.46 1.27,11.56 3.05,11.56 3.05,12.19 1.78,13.46
  pour Top: 1.4,33.02 1.4,29.59 6.22,29.59 6.22,30.48 5.84,30.86 5.84,32.77 5.59,33.02
  pour Top: 24.51,33.91 24.51,24.64 24.13,24.26 21.59,24.26 21.34,24.51 21.34,30.1 21.59,30.35 22.23,30.35 23.24,31.37 23.24,33.66 23.62,34.04 24.38,34.04
  pour Bottom: 23.62,34.04 24.38,34.04 24.51,33.91 24.51,24.64 24.13,24.26 21.59,24.26 21.34,24.51 21.34,30.1 21.59,30.35 22.23,30.35 23.24,31.37 23.24,33.66
  pour Top (isolate 0.127): 21.03,50.37 21.03,46 24.28,46 25.96,44.32 31.67,44.32 31.67,50.67 31.65,50.7 21.36,50.7
I2C_EN  (via drill 0.3)
  Top 0.254: v24.51,37.08 25.2,37.77 U6.P$1
  Bottom 0.254: U1.P$9 13.84,37.12 R20.2 14.74,36.91 19.25,36.91 20.32,37.97 22.23,37.97 23.11,37.08 v24.51,37.08
LATCH_CTRL  (via drill 0.3)
  Top 0.254: v10.29,33.15 10.29,33.53 R17.2
  Bottom 0.254: v10.29,33.15 11.3,34.16 U1.P$7
MSP_CSN  (via drill 0.3)  (1 unrouted)
  Top 0.254: v15.75,45.21 15.75,46.1 R10.2 16.17,47.02 17.69,47.02
  Bottom 0.254: v15.75,45.21 15.75,45.72 15.37,46.1 13.82,46.1 13.36,45.64 13.36,43.84 11.81,42.29 10.79,42.29 9.4,40.89 9.4,40.01 7.75,38.35 6.86,38.35 6.1,37.59 5.84,37.59 4.95,36.7 U1.P$2
MSP_RST  (via drill 0.3)
  Top 0.254: U3.10 24.76,45.73 25.02,45.47 v25.02,42.95 25.55,42.42 27.3,42.42 28.64,41.09 R21.1
  Bottom 0.254: JP2.7 28.6,26.38 28.6,28.22 27.86,28.96 27.86,40.46 25.15,43.05 v25.02,42.95 24.23,42.16 C13.2
MSP_TA
  Top 0.254: JP2.11 30.37,32.49 29.21,33.66 29.21,39.47 26.9,41.78 23.19,41.78 20.32,44.65 20.32,46.99 19.63,47.68 U3.2
MSP_TST  (via drill 0.3)
  Top 0.254: 26.87,43.31 v26.92,43.26 26.21,43.26 25.53,43.94 25.53,45.85 25,46.38 U3.11
  Bottom 0.254: JP2.8 29.26,27.71 29.26,28.57 28.57,29.26 28.57,40.89 26.92,42.55 v26.92,43.26
N$1
  Bottom 0.409: ANT1.P$1 13.81,11.65
  Bottom 0.508: 13.81,11.65 U1.P$43
N$2  (via drill 0.3)
  Top 0.254: R2.2 8.13,26.42 v8.38,26.67 8.76,27.05 10.79,27.05 11.5,26.35 Q2.1 | v14.48,32.64 14.86,33.02 Q4.1
  Bottom 0.254: v8.38,26.67 9.4,26.67 14.48,31.75 v14.48,32.64
N$3
  pour Top: 10.67,22.1 10.67,22.35 12.7,22.35 12.7,21.84 17.78,21.84 17.78,23.37 9.65,23.37 9.65,22.1
N$4  (via drill 0.3)
  Top 0.254: S4.1 14.61,26.5 v14.61,27.43 | 19.68,34.29 R8.1 R1.1 21.06,32.77 21.34,32.77 22,32.11 v22,31.45
  Bottom 0.254: v14.61,27.43 14.61,28.7 17.37,31.45 v22,31.45
N$5
  Top 0.381: U2.4 7.94,19.28 R6.1
  Top 0.508: R7.2 6.86,17.11 6.86,17.91 7.2,18.25 R6.1
N$6
  Top 0.254: R27.1 21.08,21.46 21.08,22.35 22.12,23.39 Q1.P$6 26.16,22.73 26.42,22.48 27.56,22.48 28.19,21.84 Q1.P$3
N$7  (via drill 0.3)
  Top 0.254: v4.83,33.91 4.83,34.29 5.97,35.43 5.97,38.48 5.33,39.12 4.95,39.12 4.39,39.67 J2.6
  Bottom 0.254: U1.P$62 3.17,26.04 4.45,27.3 4.45,28.57 5.84,29.97 5.84,32.77 4.83,33.78 v4.83,33.91
N$9
  Top 0.254: Q2.3 12.57,28.66 R16.1 12.34,30.2 Q3.3 12.05,31.45 Q7.3
N$10
  Top 0.254: Q4.2 17.2,34.54 R8.2
N$11  (via drill 0.3)
  Top 0.254: v6.1,33.91 6.1,34.67 6.6,35.18 6.6,38.73 v5.33,40.01
  Bottom 0.254: U1.P$61 3.17,24.77 5.08,26.67 5.08,28.07 6.6,29.72 6.6,33.27 v6.1,33.91 | J2.5 4.39,40.95 v5.33,40.01
N$12
  Top 0.254: Q1.P$1 26.16,19.25 R28.1
  Top 0.508: R28.1 R22.2
N$14  (via drill 0.3)
  Top 0.508: v2.54,35.56 4.32,35.56 R12.2
  Bottom 0.254: U1.P$67 2.92,32.38 3.17,32.64 3.17,34.16 2.54,34.8 v2.54,35.56
N$15
  Top 0.254: R12.1 3.92,37.85 LED1.A
N$16
  Top 0.254: R13.2 20.07,29.89 S3.1
N$17  (via drill 0.3)
  Top 0.254: J2.8 5.39,44.77 5.08,44.45 5.08,41.53 6.1,40.51 | 6.1,40.51 v6.73,39.88 7.24,39.37 7.24,36.58 8.13,35.69 20.95,35.69 21.34,35.31 v21.34,33.91 | 6.1,40.51 6.58,41 8.38,41 8.89,40.49 C21.1
  Bottom 0.254: v21.34,33.91 22.35,33.91 22.73,34.29 U1.P$16 | R4.1 5.46,38.61 6.22,38.61 6.73,39.12 v6.73,39.88
N$18
  Top 0.254: U3.12 26.13,47.03 O1.1 C12.1
N$20  (via drill 0.3)
  Top 0.381: TEMP.2 27.23,28.02 v27.69,27.56
  Bottom 0.381: v27.69,27.56 27.43,27.3 U1.P$23
N$21
  Top 0.254: R14.2 18.96,37.5 19.43,37.97 21.59,37.97 22.1,38.48 22.1,39.5 22.4,39.8 U6.P$4
  Top 0.508: R15.2 R14.2
N$22  (via drill 0.3)
  Top 0.254: U6.P$6 23.11,37.85 24.13,37.85 24.64,38.35 24.64,39.5 24.94,39.8 U6.P$3 26.62,39.8 v26.92,39.5
  Bottom 0.254: R18.1 26.12,39.5 v26.92,39.5
N$23
  Top 0.254: Q6.1 7.95,30.61 Q7.1 8.94,29.08 8.38,29.08 7.87,28.57 7.11,28.57 R3.2
N$24
  Top 0.254: R9.2 6.99,29.97 Q6.3 6.99,34.42 7.37,34.8 8.76,34.8 R17.1
N$25  (via drill 0.3)
  Top 0.254: R19.1 16.89,31.24 | 22.35,35.05 R11.2 v22.48,33.02
  Top 0.381: Q4.3 15.98,32.92 v15.75,32.69 | Q4.3 16.89,31.62 R19.1 | Q4.3 18.01,32.92 R1.2
  Bottom 0.254: v22.48,33.02 16.08,33.02 v15.75,32.69
P1.6
  Bottom 0.406: U1.P$32 29.86,15.88 JP2.3
P1.7
  Bottom 0.406: U1.P$33 30.37,14.61 JP2.2
P2.0
  Bottom 0.254: 20.19,16.38 U1.P$38 20.19,12.19 20.57,12.57 30.4,12.57 JP2.1
RFGND  (via drill 0.3)
  Bottom 0.254: ANT1.P$3 12.53,8.22 v12.57,8.38 | ANT1.P$2 10.53,8.25 v10.67,8.38
  Bottom 0.508: U1.P$44 12.57,12.83 12.95,13.21 14.73,13.21 15.11,12.83 U1.P$42
  other vias: 6.99,8.26 4.95,9.65 6.99,9.65 8.89,9.65 17.14,9.65 19.18,9.65 21.34,9.65 23.37,9.65 25.53,9.91 27.56,10.03 27.56,8.26 25.53,8.26 23.37,8.26 21.34,8.26 19.18,8.26 17.14,8.26 15.11,8.26 4.95,8.26 2.92,8.26 8.89,8.26 15.11,9.65 12.57,9.65 10.67,9.65 2.92,9.65 1.14,9.91 1.14,8.26 29.59,10.16 29.59,8.26
  pour Bottom (isolate 0.254, no thermals): 0.25,10.92 2.54,10.92 3.17,10.29 11.43,10.29 12.06,10.92 15.62,10.92 16.26,10.29 24.51,10.29 25.15,10.92 31.75,10.92 31.72,7.75 0.23,7.75
  pour Top: 0.25,10.67 31.5,10.67 31.5,7.92 0.28,7.92
  pour Power: 0.25,10.67 31.5,10.67 31.5,7.87 0.25,7.87
  pour Ground (rank 2): 0.25,10.67 31.5,10.67 31.5,7.87 0.25,7.87
RTC_INT  (1 unrouted)
  Top 0.254: 19.16,46.38 19.63,45.9 19.63,44.32 22.81,41.15 26.64,41.15 28.57,39.22 28.57,35.81 | 28.57,35.81 28.57,32.38 30.46,30.5 JP2.10 | R11.1 25.53,35.43 25.91,35.81 28.57,35.81
RTC_MISO  (via drill 0.3)
  Top 0.254: U3.8 22.71,44.43 22.61,44.32 22.61,43.84 v23.01,43.43 | U4.2 11.02,39.9 v11.18,39.75
  Bottom 0.254: U1.P$4 7.49,36.83 7.75,37.08 8.51,37.08 v11.18,39.75 | v11.18,39.75 11.3,39.88 | 11.3,39.88 12.7,41.27 21.46,41.27 22.86,42.67 22.86,43.41 v23.01,43.43 | v11.18,39.75 11.18,39.88 11.3,39.88
RTC_MOSI  (via drill 0.3)
  Top 0.254: v14.35,45.19 13.56,45.97 U4.5 | U3.9 22.03,45.08 v22.02,45.09 | LS1.P$6 16.37,40.52 16.26,40.64
  Top 0.508: R14.1 16.26,39.46 16.26,40.64 16.26,42.67 v15.75,43.18
  Bottom 0.254: U1.P$3 6.35,35.69 6.35,36.96 7.11,37.72 8.13,37.72 10.16,39.88 10.16,40.39 11.43,41.66 12.06,41.66 12.45,42.04 14.35,42.04 | v22.02,45.09 22.02,45.06 21.97,44.88 21.97,42.85 21.16,42.04 15.75,42.04 | 14.35,42.04 15.75,42.04 | 14.35,42.04 v14.35,45.19 | 15.75,42.04 v15.75,43.18
RTC_SCLK  (via drill 0.3)
  Top 0.254: U4.6 12.27,48.02 12.27,45.47 13.49,44.25 14.61,44.25 | 14.61,44.25 16.28,44.25 16.46,44.42 17.7,44.42 U3.7 18.29,44.43 18.29,42.16 17.95,41.82 LS1.P$4 | v14.99,40.39 14.61,40.77 14.61,44.25
  Top 0.508: R15.1 15.06,40.31 v14.99,40.39
  Bottom 0.254: U1.P$5 9.02,35.81 9.02,36.7 10.79,38.48 11.3,38.48 13.21,40.39 v14.99,40.39
RTC_XIN  (via drill 0.3)
  Top 0.254: U3.13 26.14,47.68 O1.2 C3.1 29.69,48.07 v29.69,47.52
  Bottom 0.254: JP2.12 30.48,46.99 v29.69,47.52
SFD  (2 unrouted)
TCK  (via drill 0.3)
  Top 0.254: v21.21,36.96 20.57,36.32 8.38,36.32 7.87,36.83 7.87,40.01 v8.03,40.11
  Bottom 0.254: v21.21,36.96 21.21,35.81 U1.P$15 | J2.7 5.39,42.08 6.73,40.74 7.14,40.74 v8.03,40.11
VCAP
  Top 0.254: 15.75,29.84 R16.2 14.22,29.97 14.22,30.99 14.15,31.19 Q3.2 | R19.2 16.51,29.84 16,29.84 15.75,29.84 | Q1.P$2 27.18,21.59 26.92,21.84 23.37,21.84 22.1,20.57 22.1,16.38 22.23,16.26 | S3.3 18.92,27.43 16.64,27.43 S4.3 15.75,29.84
  Top 0.381: 19.81,26.29 19.81,27.05 S3.3
  Top 0.406: C2.1 17.27,16.51 | 19.56,16.26 C1.1 | C5.1 14.99,16.51 | C6.1 12.7,16.51
  Top 0.508: C1.1 19.81,16.64 R27.2 | 18.29,20.07 18.29,20.83 19.81,22.35 19.81,26.29 C4.2
  Top 0.762: 19.56,16.26 22.23,16.26 22.73,16.26 SCM1.POS
  Top 1.016: C9.1 C6.1 C5.1 15.11,16.39 15.24,16.26 19.56,16.26 | 12.7,16.51 12.7,18.29 | 14.99,16.51 14.99,18.03 | 17.27,16.51 17.27,18.29 | 15.75,18.54 15.49,18.29 | 10.41,16.51 10.41,18.29
  pour Top: 18.29,17.91 9.65,17.91 9.65,20.07 12.7,20.07 12.7,20.32 18.29,20.32
VCC_MSP  (via drill 0.3)
  Top 0.254: 17.75,48.4 U3.1 18.86,48.33 19.05,48.51 19.05,49.84 v19.02,49.86 | R21.2 28.72,42.78 v28.45,43.05
  Top 0.508: C11.2 18.82,49.68 v19.02,49.86
  Bottom 0.254: JP2.9 30.48,28.52 29.21,29.79 29.21,43.18 | 26.98,46.05 B1.POS1 27.05,45.97 28.83,45.97 29.21,45.59 29.21,43.18 | v28.45,43.05 29.08,43.05 29.21,43.18
  Bottom 0.305: 19.02,48.77 v19.02,49.86
  Bottom 0.508: B1.POS2 12.7,47.37 14.35,47.37 15.75,48.77 19.02,48.77 22.61,48.77 25.27,46.1 B1.POS1
VOUT
  Top 0.381: U2.5 8.89,20.57 8.64,20.83 6.49,20.83 C19.1 | 5.35,15.24 5.35,18.39 R6.2
  Top 0.508: C14.1 5.35,15.24 L1.1
  pour Top: 6.6,18.03 3.43,18.03 3.43,21.59 6.6,21.59
VREG  (via drill 0.3)
  Top 0.254: LS1.P$1 19.32,39.32 C7.2 | U6.P$2 26.28,38.79 26.62,38.44 26.62,36.75 v26.67,36.7 | U4.7 11.02,46.23 9.75,46.23
  Top 0.305: U4.3 12.29,44.37 11.02,45.64 U4.7 11.04,48.06 | U4.8 9.75,46.23 9.75,43.84 10.29,43.31 v10.26,43.31
  Top 0.381: TEMP.1 C8.1 26.04,34.16 v26.82,34.95
  Top 0.508: L1.2 6.48,13.22 C16.1 | U4.8 9.75,49.67 C10.2 | v18.03,39.12 19.47,39.12 C7.2
  Top 0.762: 4.17,13.22 L1.2
  Top 0.813: v3.68,13.72 4.17,13.22
  Power 0.508: v21.46,13.21 21.72,13.34
  Bottom 0.254: v26.67,36.7 26.67,37.25 R18.2
  Bottom 0.381: v26.82,34.95 26.71,34.96
  Bottom 0.508: U1.P$51 v3.68,13.72 v3.68,14.99 v3.68,16.26 | 21.59,13.34 U1.P$34 | v21.59,14.48 21.59,13.34 | 21.59,13.34 v21.46,13.21 | J2.3 3.39,38.81 R4.2 3.47,37.76 2.92,37.21 1.79,37.21 | 1.79,37.21 JP1.2 | 1.79,37.21 1.27,36.69 1.27,33.78 1.4,33.66 U1.P$68 | 26.16,35.56 26.21,35.56 v26.82,34.95 | 26.16,35.56 U1.P$17 | v26.67,36.7 26.67,36.07 26.16,35.56
  pour Power: 0.25,40.77 8.76,40.77 arc90 9.4,41.4 9.4,50.42 31.62,50.16 31.62,35.81 29.21,35.81 29.21,12.65 25.35,12.65 arc90 24.51,11.94 arc-90 23.88,11.43 4.06,11.43 arc-90 3.43,11.94 arc90 2.34,12.78 0.38,12.78
  pour Top: 3.05,16.64 3.05,13.59 3.68,12.95 4.32,12.95 4.32,16.51 3.94,16.89 3.3,16.89
VREG_EN  (via drill 0.3)
  Top 0.254: U2.3 7.94,23.3 v7.87,23.37 | v8.51,27.94 R5.2 10.16,28.19 10.16,30.1 9.78,30.48 9.14,30.48 8.91,30.71 Q6.2 9.47,32.38 12.45,32.38 13.31,33.25 Q3.1
  Bottom 0.254: v7.87,23.37 7.37,23.88 7.37,27.43 7.87,27.94 v8.51,27.94

### Text on the board
tPlace: Yerva, Grunnagle | Rev: 1C | Gecko